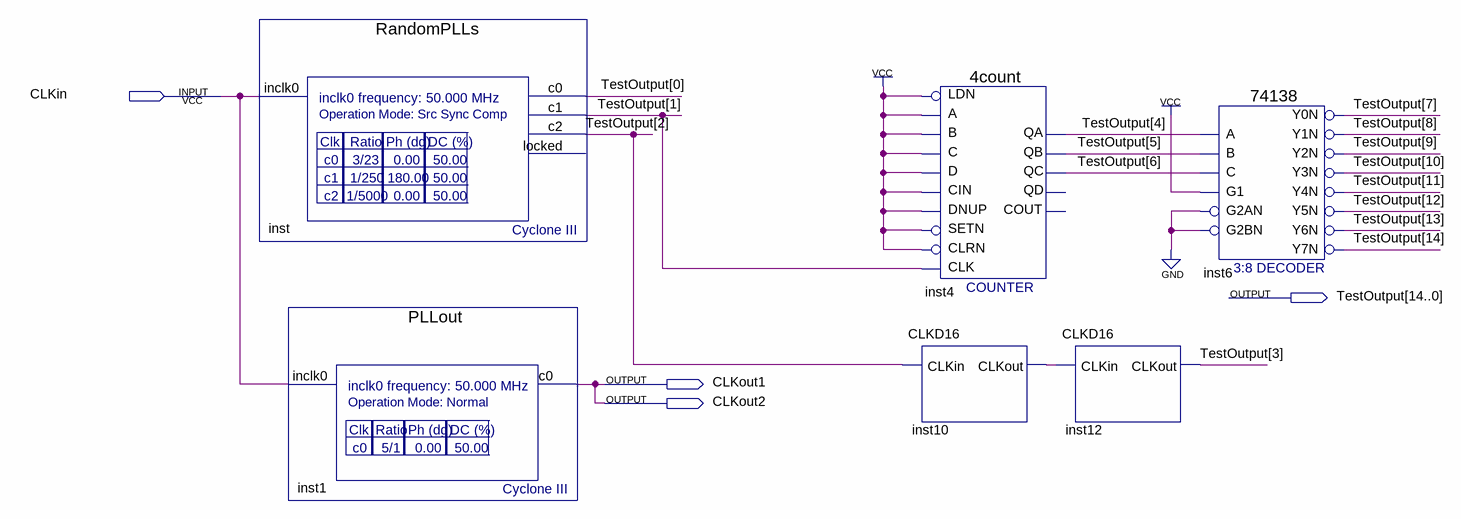
[diagram p0: schematic sheet]
// Quartus schematic RandomSeq.bdf as structural Verilog: 6 symbols, 4 pins
module RandomSeq (
  input  CLKin,
  output [14:0] TestOutput,
  output CLKout1,
  output CLKout2
);

  wire inst10_clkout;

  RandomPLLs inst (.inclk0(CLKin), .c0(TestOutput[0]), .c1(TestOutput[1]), .c2(TestOutput[2]));  // open: locked
  PLLout inst1 (.inclk0(CLKin), .c0(CLKout1));
  \4count  inst4 (
    .LDN(1'b1), .B(1'b1), .A(1'b1), .D(1'b1), .CIN(1'b1), .DNUP(1'b1), .CLK(TestOutput[1]), .SETN(1'b1),
    .C(1'b1), .CLRN(1'b1), .QA(TestOutput[4]), .QB(TestOutput[5]), .QC(TestOutput[6]));  // open: QD, COUT
  CLKD16 inst10 (.CLKin(TestOutput[2]), .CLKout(inst10_clkout));
  CLKD16 inst12 (.CLKin(inst10_clkout), .CLKout(TestOutput[3]));
  \74138  inst6 (
    .A(TestOutput[4]), .B(TestOutput[5]), .G1(1'b1), .C(TestOutput[6]), .G2AN(1'b0), .G2BN(1'b0),
    .Y0N(TestOutput[7]), .Y1N(TestOutput[8]), .Y2N(TestOutput[9]), .Y3N(TestOutput[10]),
    .Y4N(TestOutput[11]), .Y5N(TestOutput[12]), .Y6N(TestOutput[13]), .Y7N(TestOutput[14]));

  assign CLKout2 = CLKout1;
endmodule
